# Altium schematic sheet Sheet1.SchDoc
size C; SheetNumber: 1; SheetTotal: 1
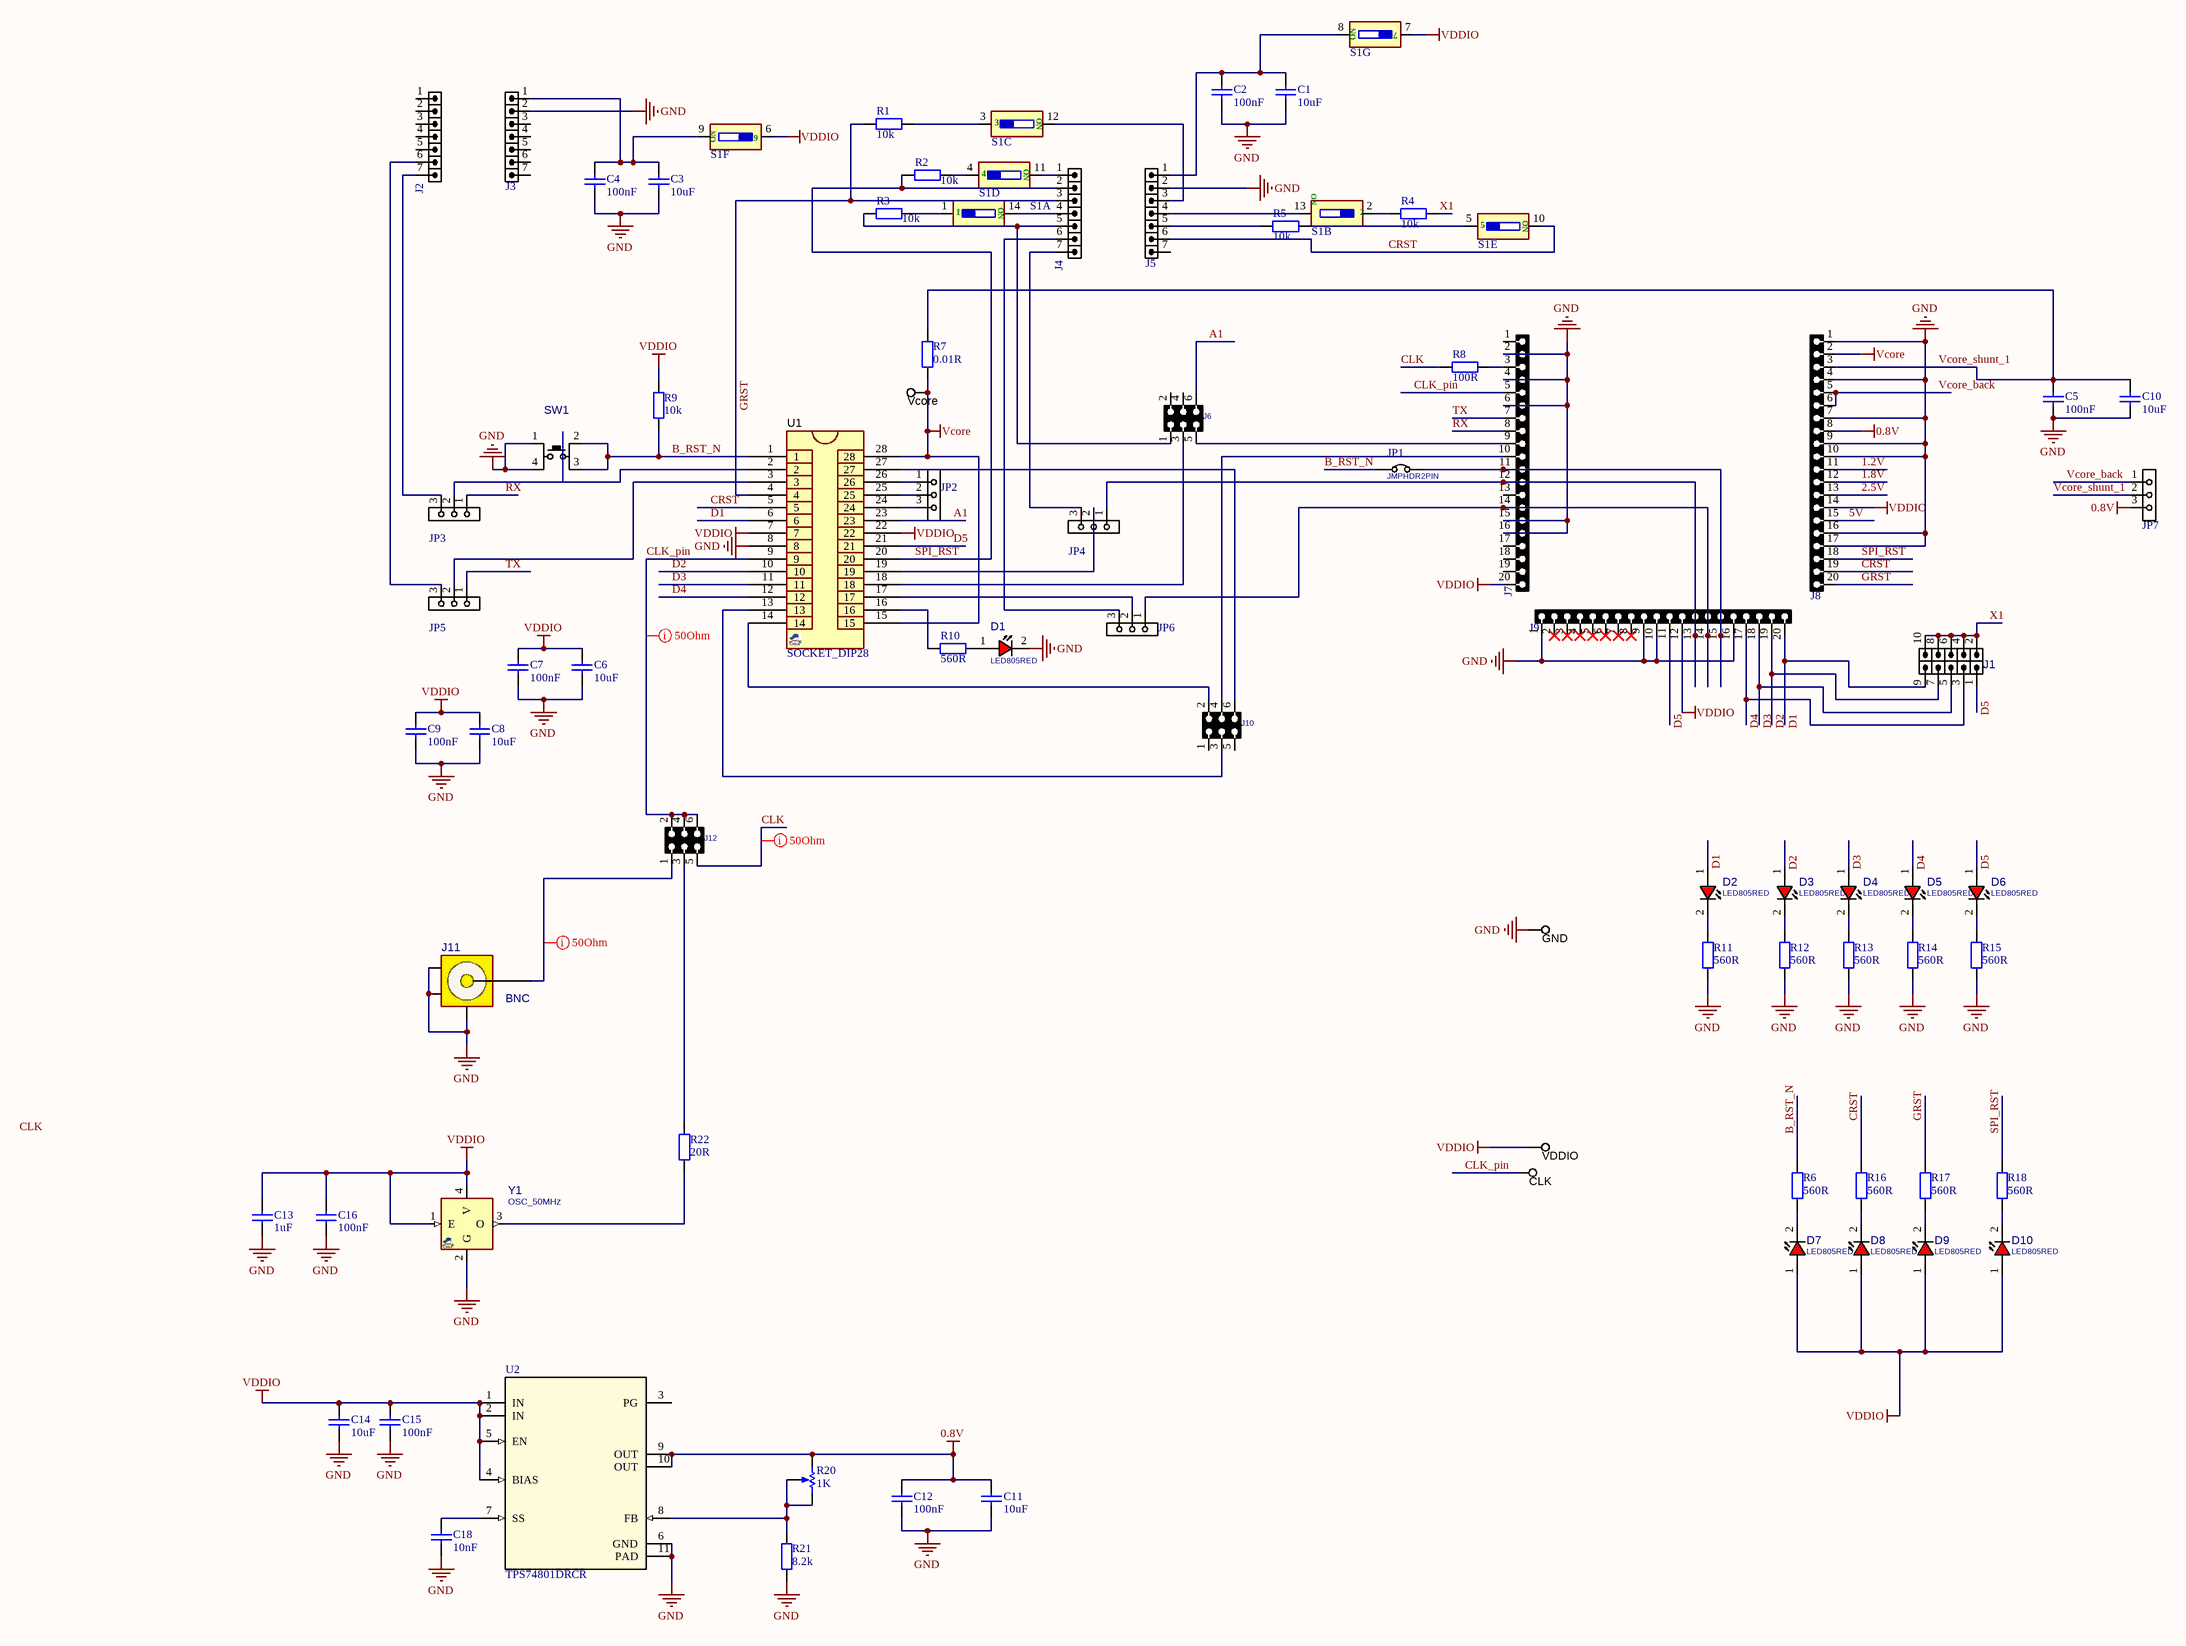
[diagram p0: Sheet1.SchDoc]

## Parts
C1  10uF  [C1210]
C2  100nF  [C0805]
C3  10uF  [C1210]
C4  100nF  [C0805]
C5  100nF  [C0805]
C6  10uF  [C1210]
C7  100nF  [C0805]
C8  10uF  [C1210]
C9  100nF  [C0805]
C10  10uF  [C1210]
C11  10uF  [C1210]
C12  100nF  [C0805]
C13  1uF  [C0805]
C14  10uF  [C1210]
C15  100nF  [C0805]
C16  100nF  [C0805]
C18  10nF  [C0805]
CLK  TESTPOINT_BIG_BLK1  [TPTHD_C_BLK1]  (value not drawn)  (no BOM)
D1  LED805RED  [LED0805RED]
D2  LED805RED  [LED0805RED]
D3  LED805RED  [LED0805RED]
D4  LED805RED  [LED0805RED]
D5  LED805RED  [LED0805RED]
D6  LED805RED  [LED0805RED]
D7  LED805RED  [LED0805RED]
D8  LED805RED  [LED0805RED]
D9  LED805RED  [LED0805RED]
D10  LED805RED  [LED0805RED]
GND  TESTPOINT_BIG_BLK1  [TPTHD_C_BLK1]  (value not drawn)  (no BOM)
J1  HDRM_2X5  [HDR_M_2X5]  (value not drawn)
J2  HDR1X7  [HDR_M_1X7]  (value not drawn)
J3  HDR1X7  [HDR_M_1X7]  (value not drawn)
J4  HDR1X7  [HDR_M_1X7]  (value not drawn)
J5  HDR1X7  [HDR_M_1X7]  (value not drawn)
J6  HDRF_2X3  [HDR_F_2X3]  (value not drawn)
J7  HDRF20  [HDR_F_1X20]  (value not drawn)
J8  HDRF20  [HDR_F_1X20]  (value not drawn)
J9  HDRF20  [HDR_F_1X20]  (value not drawn)
J10  HDRF_2X3  [HDR_F_2X3]  (value not drawn)
J11  BNC  [MCX5.08-V5]
J12  HDRF_2X3  [HDR_F_2X3]  (value not drawn)
JP1  JMPHDR2PIN  [JP_2_BLK]
JP2  JMPHDR3PIN  [JP_3]  (value not drawn)
JP3  JMPHDR3PIN  [JP_3]  (value not drawn)
JP4  JMPHDR3PIN  [JP_3]  (value not drawn)
JP5  JMPHDR3PIN  [JP_3]  (value not drawn)
JP6  JMPHDR3PIN  [JP_3]  (value not drawn)
JP7  JMPHDR3PIN  [JP_3]  (value not drawn)
R1  10k  [R0805]
R2  10k  [R0805]
R3  10k  [R0805]
R4  10k  [R0805]
R5  10k  [R0805]
R6  560R  [R0805]
R7  0.01R  [R1206]
R8  100R  [R0805]
R9  10k  [R0805]
R10  560R  [R0805]
R11  560R  [R0805]
R12  560R  [R0805]
R13  560R  [R0805]
R14  560R  [R0805]
R15  560R  [R0805]
R16  560R  [R0805]
R17  560R  [R0805]
R18  560R  [R0805]
R20  1K  [Pot-a]
R21  8.2k  [R0805]
R22  20R  [R0805]
S1  DIPSW7  [DIPSW254S_7]  (value not drawn)  (parts A,B,C,D,E,F,G of 7)
SW1  PUSHBUTTON  [SWPBS_SPDT_5X5X1]  (value not drawn)
U1  SOCKET_DIP28  [DIP28_sckt]
U2  TPS74801DRCR  [DRC0010A]
Vcore  TESTPOINT_BIG_BLK1  [TPTHD_C_BLK1]  (value not drawn)  (no BOM)
VDDIO  TESTPOINT_BIG_BLK1  [TPTHD_C_BLK1]  (value not drawn)  (no BOM)
Y1  OSC_50MHz  [XTL_4_3225GEN]

## Nets
0.8V: C11.2 C12.1 J8.8 JP7.3 R20.1(TOP) U2.9(OUT) U2.10(OUT)
GND: C1.1 C2.2 C3.1 C4.2 C5.1 C6.1 C7.2 C8.1 C9.2 C10.1 C11.1 C12.2 C13.2 C14.1 C15.2 C16.2 C18.2 D1.2(CATHODE) GND.1 J3.2 J5.2 J7.2 J7.4 J7.6 J7.15 J7.16 J8.1 J8.4 J8.7 J8.9 J8.10 J8.16 J8.17 J9.1 J9.9 J9.10 J9.16 J11.2(GND) J11.MH1 J11.MH2 R11.1 R12.1 R13.1 R14.1 R15.1 R21.1 SW1.1(P1) SW1.4(P2) U1.8 U2.6(GND) U2.11(PAD) Y1.2(G)
Vcore: J8.2 R7.1 U1.15 U1.28 Vcore.1
VDDIO: C6.2 C7.1 C8.2 C9.1 C13.1 C14.2 C15.1 C16.1 D7.1(ANODE) D8.1(ANODE) D9.1(ANODE) D10.1(ANODE) J7.20 J8.14 J9.12 R9.2 S1.6(A6) S1.7(A7) U1.7 U1.22 U2.1(IN) U2.2(IN) U2.4(BIAS) U2.5(EN) VDDIO.1 Y1.1(E) Y1.4(V)
1.2V: J8.11
1.8V: J8.12
2.5V: J8.13
5V: J8.15
A1: J6.6 U1.23
B_RST_N: JP1.1 R6.1 R9.1 SW1.2(P3) SW1.3(P4) U1.1
CLK: J12.5 R8.2
CLK_pin: CLK.1 J7.5 J12.2 J12.4 J12.6 U1.9
CRST: J5.6 J8.19 R16.1 S1.10(B5) U1.5
D1: D2.1(ANODE) J1.9 J9.20 U1.6
D2: D3.1(ANODE) J1.7 J9.19 U1.10
D3: D4.1(ANODE) J1.5 J9.18 U1.11
D4: D5.1(ANODE) J1.3 J9.17 U1.12
D5: D6.1(ANODE) J1.1 J9.11 U1.21
GRST: J4.3 J8.20 R1.2 R17.1 U1.4
RX: J7.8 JP3.1
SPI_RST: J4.2 J8.18 R2.2 R18.1 U1.20
TX: J7.7 JP5.1
Vcore_back: J8.5 J8.6 JP7.1
Vcore_shunt_1: C5.2 C10.2 J8.3 JP7.2 R7.2
X1: J1.2 J1.4 J1.6 J1.8 J1.10 R4.1
NetC1_2: C1.2 C2.1 J5.1 S1.8(B7)
NetC3_2: C3.2 C4.1 J3.1 S1.9(B6)
NetC18_1: C18.1 U2.7(SS)
NetD1_1: D1.1(ANODE) R10.1
NetD2_2: D2.2(CATHODE) R11.2
NetD3_2: D3.2(CATHODE) R12.2
NetD4_2: D4.2(CATHODE) R13.2
NetD5_2: D5.2(CATHODE) R14.2
NetD6_2: D6.2(CATHODE) R15.2
NetD7_2: D7.2(CATHODE) R6.2
NetD8_2: D8.2(CATHODE) R16.2
NetD9_2: D9.2(CATHODE) R17.2
NetD10_2: D10.2(CATHODE) R18.2
NetJ2_6: J2.6 JP5.3
NetJ2_7: J2.7 JP3.3
NetJ4_1: J4.1 S1.11(B4)
NetJ4_4: J4.4 S1.14(B1)
NetJ4_5: J4.5 J6.1 R3.2
NetJ4_6: J4.6 JP6.3
NetJ4_7: J4.7 JP4.3
NetJ5_3: J5.3 S1.12(B3)
NetJ5_4: J5.4 S1.13(B2)
NetJ5_5: J5.5 R5.2
NetJ6_3: J6.3 U1.18
NetJ6_5: J6.5 J7.9
NetJ7_3: J7.3 R8.1
NetJ7_10: J7.10 J10.4
NetJ7_11: J7.11 J9.15 JP1.2
NetJ7_12: J7.12 J9.13 JP4.1
NetJ7_14: J7.14 J9.14 JP6.1
NetJ10_2: J10.2 U1.14
NetJ10_3: J10.3 U1.13
NetJ10_6: J10.6 U1.27
NetJ11_1: J11.1(SIG) J12.1
NetJ12_3: J12.3 R22.2
NetJP2_1: JP2.1 U1.26
NetJP2_2: JP2.2 U1.25
NetJP2_3: JP2.3 U1.24
NetJP3_2: JP3.2 U1.2
NetJP4_2: JP4.2 U1.19
NetJP5_2: JP5.2 U1.3
NetJP6_2: JP6.2 U1.17
NetR1_1: R1.1 S1.3(A3)
NetR2_1: R2.1 S1.4(A4)
NetR3_1: R3.1 S1.1(A1)
NetR4_2: R4.2 S1.2(A2)
NetR5_1: R5.1 S1.5(A5)
NetR10_2: R10.2 U1.16
NetR20_2: R20.2(TAP) R20.3(BOT) R21.2 U2.8(FB)
NetR22_1: R22.1 Y1.3(O)

Not connected (* = marked no-connect by the designer): J2 1 2 3 4 5; J3 3 4 5 6 7; J5 7; J6 2 4; J7 1 13 17 18 19; J9 2* 3* 4* 5* 6* 7* 8*; J10 1 5; U2 3(PG)

## Layout directives
rule Width Constraint [Pref Impedance = 50.00ohms    Min Impedance = 50.00ohms    Max Impedance = 50.00ohms]: CLK, CLK_pin, NetJ11_1

## Notes on the sheet
- Labels drawn without touching a wire or pin: CLK
- (in symbol DIPSW254S_7P, part A) ON
- (in symbol DIPSW254S_7P, part B) ON
- (in symbol DIPSW254S_7P, part C) ON
- (in symbol DIPSW254S_7P, part D) ON
- (in symbol DIPSW254S_7P, part E) ON
- (in symbol DIPSW254S_7P, part F) ON
- (in symbol DIPSW254S_7P, part G) ON

## Library data of the parts
C1-C16 C18 = cap_SMD: smd capacitor 1206
  C1 C3 C6 C8 C10 C11 C14: Value: 10uF
  C2 C4 C5 C7 C9 C12 C15 C16: Value: 100nF
  C13: Value: 1uF
  C18: Value: 10nF
CLK GND Vcore VDDIO = TESTPOINT_BIG_BLK1: TEST POINT; MANF: MANF; MANF_P#: MANF_P#; VALUE: VALUE
D1-D10 = LED_SMD_0805_RED: LED, SMD, 0805, RED; DESC: DESCRIPTION; MANF_P#: MANF_PART#; PARAM2: 2.2V; MANF: MANF; ASSEMBLY: ASSEMBLY; PRICE: 36t@Javan; VALUE: LED805RED
J1 = HDR_M_2X5: CONN, HEADER, Male, pitch: 2.54mm, 10POS; VALUE: HDRM_2X5
J2-J5 = HDR_M_1X7: CONN, HEADER, Male, pitch: 2.54mm, 7POS; VALUE: HDRM7
J6 J10 J12 = HDR_F_2X3: CONN, HEADER, Female, pitch: 2.54mm, 6POS; MANF_P#: MANF_PART#; MANF: MANF; VALUE: HDRF_2X3
J7-J9 = HDR_F_1X20: CONN, HEADER, Female, pitch: 2.54mm, 20POS; VALUE: HDRF20
J11 = CONN_RF_BNC_RA: CONN, RF, BNC, STRAIGHT; MANF_P#: 5413515-9; MANF: TE; PARAM: 50Ohm, -GHz; DESC: DESCRIPTION; DIST#: MOUSER; PARAM2: GOLD; ASSEMBLY: ASSEMBLY; PRICE: 5$; VALUE: BNC
JP1 = JUMPER_HDR_2P: JUMPER, HEADER 2PIN; MANF: MANF; MANF_P#: MANF_P#; VALUE: JMPHDR2PIN
JP2-JP7 = JUMPER_HDR_3P: JUMPER, HEADER 3PIN; MANF: MANF; MANF_P#: MANF_P#; VALUE: JMPHDR3PIN
R1-R18 R21 R22 = Res_SMD: resistors_axial_smd
  R1-R5 R9: Value: 10k
  R6 R10-R18: Value: 560R
  R7: Value: 0.01R
  R8: Value: 100R
  R21: Value: 8.2k
  R22: Value: 20R
R20 = ResPot: potansiometer; value: 1K
S1 = DIPSW254S_7P: SWITCH, DIP, 7P, THD; MANF: MANF; MANF_P#: MANF_P#; VALUE: DIPSW7
SW1 = SWPBS_SPDT_5X5X1_SKQGAFE010: SWITCH, PUSH BUTTON, TACTILE, SMD, SPDT, 5.0X5.0X1.5MM; MANF: ALPS; DESC: DESCRIPTION; VALUE: PUSHBUTTON; ASSEMBLY: ASSEMBLY; PARAM: PARAM; PRICE: PRICE; MANF_P#: SKQGAFE010
U1 = SOCKET_IC_DIP_28: SOCKET, IC DIP,; PARAM: -; PARAM2: -; MANF_P#: -; MANF: -; PRICE: -; VALUE: SOCKET_DIP28
U2 = TPS74801DRCR: 1.5-A low-VIN (0.8 V) adjustable low-dropout (LDO) voltage regulator with power good and enable 10-VSON -40 to 125; Manufacturer_Name: Texas Instruments; Alternate_PartNumber: TPS74801DRCT; CompType: IC; TYPE: TYPE; RefDes: RefDes; Copyright: Copyright (C) 2026 Ultra Librarian. All rights reserved.; Manufacturer_Part_Number: TPS74801DRCR; Application_BuildNumber: *; PartNumber: TPS74801DRCR; PackageReference: DRC0010A; MountType: SMT; RoHS: Y; Manufacturer: Texas Instruments
Y1 = OSC_4_50MHz_3225E: CLOCK OSCILLATOR, 50MHz, 10PPM, 3225; MANF: ECS; DESC: DESCRIPTION; DIST#: MOUSER; MANF_P#: ECS-3225S33-500-FN-TR; PARAM2: 1.8~3.3V, -40~85oC; ASSEMBLY: ASSEMBLY; PARAM: 10PPM; PRICE: 1.2$; Value: OSC_50MHz